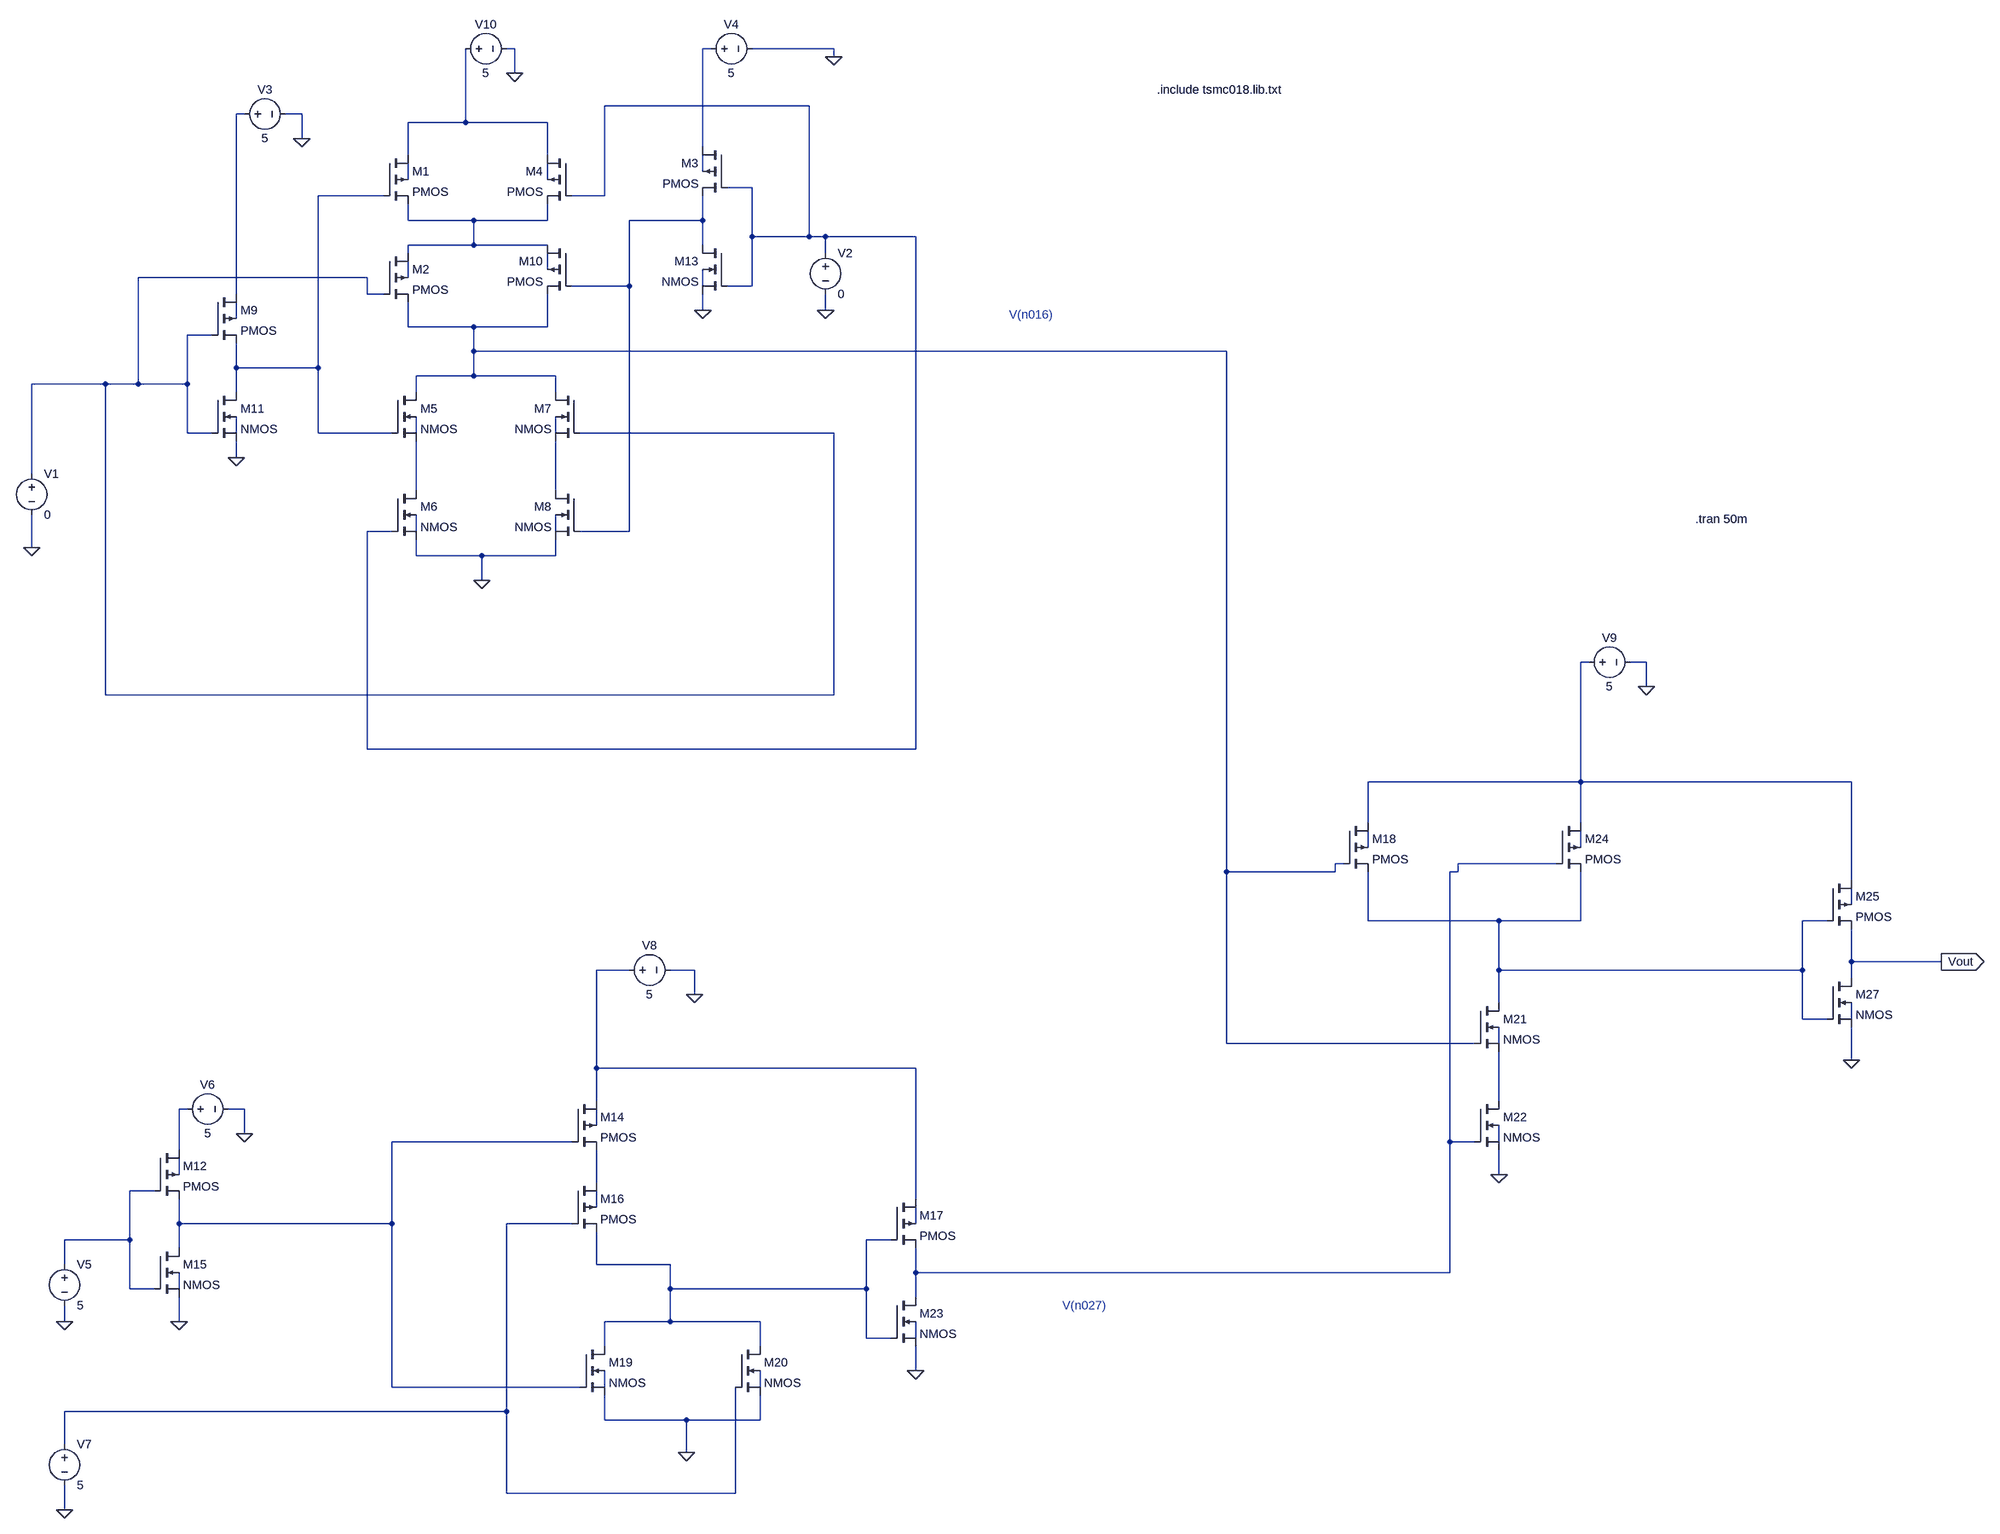
[diagram p0: schematic Analog Mastery Circuit.asc]
Analog Mastery Circuit.asc, the LTspice schematic file:
Version 4
SHEET 1 4448 2804
WIRE 288 -144 272 -144
WIRE 672 -144 656 -144
WIRE 912 -144 752 -144
WIRE 912 -128 912 -144
WIRE 288 -96 288 -144
WIRE 864 -32 464 -32
WIRE -240 -16 -256 -16
WIRE -128 -16 -160 -16
WIRE 192 0 192 -144
WIRE 192 0 80 0
WIRE 352 0 192 0
WIRE -128 32 -128 -16
WIRE 656 48 656 -144
WIRE 80 64 80 0
WIRE 352 64 352 0
WIRE 656 96 656 64
WIRE 80 112 80 80
WIRE 352 112 352 80
WIRE 752 128 704 128
WIRE 32 144 -96 144
WIRE 464 144 464 -32
WIRE 464 144 400 144
WIRE 80 192 80 160
WIRE 208 192 80 192
WIRE 352 192 352 160
WIRE 352 192 208 192
WIRE 656 192 656 144
WIRE 656 192 512 192
WIRE 752 224 752 128
WIRE 864 224 864 -32
WIRE 864 224 752 224
WIRE 896 224 864 224
WIRE 1072 224 896 224
WIRE 208 240 208 192
WIRE 208 240 80 240
WIRE 352 240 208 240
WIRE 656 240 656 192
WIRE 80 256 80 240
WIRE 896 256 896 224
WIRE 352 288 352 256
WIRE 0 304 -448 304
WIRE 80 304 80 272
WIRE 512 320 512 192
WIRE 512 320 400 320
WIRE 656 320 656 288
WIRE 752 320 752 224
WIRE 752 320 704 320
WIRE -256 336 -256 -16
WIRE 0 336 0 304
WIRE 32 336 0 336
WIRE 656 368 656 336
WIRE 896 368 896 336
WIRE -256 384 -256 352
WIRE 80 400 80 352
WIRE 208 400 80 400
WIRE 352 400 352 336
WIRE 352 400 208 400
WIRE -304 416 -352 416
WIRE 208 448 208 400
WIRE 2720 448 208 448
WIRE -256 480 -256 432
WIRE -96 480 -96 144
WIRE -96 480 -256 480
WIRE 208 496 208 448
WIRE 208 496 96 496
WIRE 368 496 208 496
WIRE -512 512 -656 512
WIRE -448 512 -448 304
WIRE -448 512 -512 512
WIRE -352 512 -352 416
WIRE -352 512 -448 512
WIRE -256 528 -256 480
WIRE 96 528 96 496
WIRE 368 528 368 496
WIRE -352 608 -352 512
WIRE -304 608 -352 608
WIRE -256 608 -256 576
WIRE -96 608 -96 480
WIRE 48 608 -96 608
WIRE 96 608 96 576
WIRE 368 608 368 576
WIRE 912 608 416 608
WIRE -256 656 -256 624
WIRE -656 688 -656 512
WIRE 96 720 96 624
WIRE 368 720 368 624
WIRE 48 800 0 800
WIRE 96 800 96 768
WIRE 368 800 368 768
WIRE 512 800 512 320
WIRE 512 800 416 800
WIRE -656 832 -656 768
WIRE 96 848 96 816
WIRE 224 848 96 848
WIRE 368 848 368 816
WIRE 368 848 224 848
WIRE 224 896 224 848
WIRE 3552 1056 3536 1056
WIRE 3664 1056 3632 1056
WIRE 3664 1104 3664 1056
WIRE -512 1120 -512 512
WIRE 912 1120 912 608
WIRE 912 1120 -512 1120
WIRE 0 1248 0 800
WIRE 1072 1248 1072 224
WIRE 1072 1248 0 1248
WIRE 3536 1312 3536 1056
WIRE 3536 1312 3120 1312
WIRE 4160 1312 3536 1312
WIRE 3120 1392 3120 1312
WIRE 3536 1392 3536 1312
WIRE 3120 1440 3120 1408
WIRE 3536 1440 3536 1408
WIRE 3072 1472 3056 1472
WIRE 3488 1472 3296 1472
WIRE 2720 1488 2720 448
WIRE 3056 1488 3056 1472
WIRE 3056 1488 2720 1488
WIRE 3296 1488 3296 1472
WIRE 3296 1488 3280 1488
WIRE 4160 1504 4160 1312
WIRE 4160 1552 4160 1520
WIRE 3120 1584 3120 1488
WIRE 3376 1584 3120 1584
WIRE 3536 1584 3536 1488
WIRE 3536 1584 3376 1584
WIRE 4112 1584 4064 1584
WIRE 4160 1664 4160 1600
WIRE 4336 1664 4160 1664
WIRE 512 1680 448 1680
WIRE 640 1680 592 1680
WIRE 3376 1680 3376 1584
WIRE 4064 1680 4064 1584
WIRE 4064 1680 3376 1680
WIRE 4160 1696 4160 1664
WIRE 640 1728 640 1680
WIRE 3376 1744 3376 1680
WIRE 4064 1776 4064 1680
WIRE 4112 1776 4064 1776
WIRE 4160 1776 4160 1744
WIRE 2720 1824 2720 1488
WIRE 3328 1824 2720 1824
WIRE 3376 1824 3376 1792
WIRE 4160 1856 4160 1792
WIRE 448 1872 448 1680
WIRE 1072 1872 448 1872
WIRE 448 1936 448 1872
WIRE 3376 1936 3376 1840
WIRE -352 1952 -368 1952
WIRE -240 1952 -272 1952
WIRE 448 1984 448 1952
WIRE -240 2000 -240 1952
WIRE 400 2016 48 2016
WIRE 3280 2016 3280 1488
WIRE 3328 2016 3280 2016
WIRE 3376 2016 3376 1984
WIRE -368 2032 -368 1952
WIRE -368 2080 -368 2048
WIRE 3376 2080 3376 2032
WIRE 448 2096 448 2032
WIRE -416 2112 -464 2112
WIRE 1072 2128 1072 1872
WIRE 448 2144 448 2112
WIRE -368 2176 -368 2128
WIRE 48 2176 48 2016
WIRE 48 2176 -368 2176
WIRE 400 2176 272 2176
WIRE 1072 2176 1072 2144
WIRE -464 2208 -464 2112
WIRE -464 2208 -592 2208
WIRE 1024 2208 976 2208
WIRE -368 2224 -368 2176
WIRE -592 2256 -592 2208
WIRE 448 2256 448 2192
WIRE 592 2256 448 2256
WIRE 1072 2272 1072 2224
WIRE 3280 2272 3280 2016
WIRE 3280 2272 1072 2272
WIRE -464 2304 -464 2208
WIRE -416 2304 -464 2304
WIRE -368 2304 -368 2272
WIRE 592 2304 592 2256
WIRE 976 2304 976 2208
WIRE 976 2304 592 2304
WIRE 1072 2320 1072 2272
WIRE -592 2368 -592 2336
WIRE -368 2368 -368 2320
WIRE 592 2368 592 2304
WIRE 592 2368 464 2368
WIRE 768 2368 592 2368
WIRE 976 2400 976 2304
WIRE 1024 2400 976 2400
WIRE 1072 2400 1072 2368
WIRE 464 2416 464 2368
WIRE 768 2416 768 2368
WIRE 1072 2464 1072 2416
WIRE 48 2496 48 2176
WIRE 416 2496 48 2496
WIRE 464 2496 464 2464
WIRE 768 2496 768 2464
WIRE 272 2544 272 2176
WIRE 272 2544 -592 2544
WIRE 464 2560 464 2512
WIRE 624 2560 464 2560
WIRE 768 2560 768 2512
WIRE 768 2560 624 2560
WIRE -592 2608 -592 2544
WIRE 624 2624 624 2560
WIRE 272 2704 272 2544
WIRE 720 2704 720 2496
WIRE 720 2704 272 2704
WIRE -592 2736 -592 2688
FLAG 224 896 0
FLAG -656 832 0
FLAG -256 656 0
FLAG 656 368 0
FLAG 896 368 0
FLAG -128 32 0
FLAG 912 -128 0
FLAG -592 2368 0
FLAG -240 2000 0
FLAG -592 2736 0
FLAG 624 2624 0
FLAG 1072 2464 0
FLAG 640 1728 0
FLAG 3376 2080 0
FLAG 3664 1104 0
FLAG 4160 1856 0
FLAG -368 2368 0
FLAG 4336 1664 Vout
IOPIN 4336 1664 Out
FLAG 288 -96 0
SYMBOL nmos4 48 528 R0
SYMATTR InstName M5
SYMBOL nmos4 48 720 R0
SYMATTR InstName M6
SYMBOL nmos4 416 528 M0
SYMATTR InstName M7
SYMBOL nmos4 416 720 M0
SYMATTR InstName M8
SYMBOL nmos4 -304 528 R0
SYMATTR InstName M11
SYMBOL nmos4 704 240 M0
SYMATTR InstName M13
SYMBOL voltage -656 672 R0
WINDOW 123 0 0 Left 0
WINDOW 39 0 0 Left 0
SYMATTR InstName V1
SYMATTR Value 0
SYMBOL voltage 896 240 R0
WINDOW 123 0 0 Left 0
WINDOW 39 0 0 Left 0
SYMATTR InstName V2
SYMATTR Value 0
SYMBOL voltage -256 -16 R270
WINDOW 0 32 56 VTop 2
WINDOW 3 -32 56 VBottom 2
WINDOW 123 0 0 Left 0
WINDOW 39 0 0 Left 0
SYMATTR InstName V3
SYMATTR Value 5
SYMBOL voltage 656 -144 R270
WINDOW 0 32 56 VTop 2
WINDOW 3 -32 56 VBottom 2
WINDOW 123 0 0 Left 0
WINDOW 39 0 0 Left 0
SYMATTR InstName V4
SYMATTR Value 5
SYMBOL nmos4 -416 2224 R0
SYMATTR InstName M15
SYMBOL voltage -592 2240 R0
WINDOW 123 0 0 Left 0
WINDOW 39 0 0 Left 0
SYMATTR InstName V5
SYMATTR Value 5
SYMBOL voltage -368 1952 R270
WINDOW 0 32 56 VTop 2
WINDOW 3 -32 56 VBottom 2
WINDOW 123 0 0 Left 0
WINDOW 39 0 0 Left 0
SYMATTR InstName V6
SYMATTR Value 5
SYMBOL voltage -592 2592 R0
WINDOW 123 0 0 Left 0
WINDOW 39 0 0 Left 0
SYMATTR InstName V7
SYMATTR Value 5
SYMBOL nmos4 416 2416 R0
SYMATTR InstName M19
SYMBOL nmos4 720 2416 R0
SYMATTR InstName M20
SYMBOL nmos4 1024 2320 R0
SYMATTR InstName M23
SYMBOL voltage 496 1680 R270
WINDOW 0 32 56 VTop 2
WINDOW 3 -32 56 VBottom 2
WINDOW 123 0 0 Left 0
WINDOW 39 0 0 Left 0
SYMATTR InstName V8
SYMATTR Value 5
SYMBOL nmos4 3328 1744 R0
SYMATTR InstName M21
SYMBOL nmos4 3328 1936 R0
SYMATTR InstName M22
SYMBOL nmos4 4112 1696 R0
SYMATTR InstName M27
SYMBOL voltage 3536 1056 R270
WINDOW 0 32 56 VTop 2
WINDOW 3 -32 56 VBottom 2
WINDOW 123 0 0 Left 0
WINDOW 39 0 0 Left 0
SYMATTR InstName V9
SYMATTR Value 5
SYMBOL voltage 176 -144 R270
WINDOW 0 32 56 VTop 2
WINDOW 3 -32 56 VBottom 2
WINDOW 123 0 0 Left 0
WINDOW 39 0 0 Left 0
SYMATTR InstName V10
SYMATTR Value 5
SYMBOL pmos4 -304 336 R0
SYMATTR InstName M9
SYMBOL pmos4 32 64 R0
SYMATTR InstName M1
SYMBOL pmos4 32 256 R0
SYMATTR InstName M2
SYMBOL pmos4 704 48 M0
SYMATTR InstName M3
SYMBOL pmos4 400 64 M0
SYMATTR InstName M4
SYMBOL pmos4 400 240 M0
SYMATTR InstName M10
SYMBOL pmos4 -416 2032 R0
SYMATTR InstName M12
SYMBOL pmos4 400 1936 R0
SYMATTR InstName M14
SYMBOL pmos4 400 2096 R0
SYMATTR InstName M16
SYMBOL pmos4 1024 2128 R0
SYMATTR InstName M17
SYMBOL pmos4 3072 1392 R0
SYMATTR InstName M18
SYMBOL pmos4 3488 1392 R0
SYMATTR InstName M24
SYMBOL pmos4 4112 1504 R0
SYMATTR InstName M25
TEXT 2584 -64 Left 2 !.include tsmc018.lib.txt
TEXT 3760 776 Left 2 !.tran 50m
TEXT 1520 376 Left 2 ;V(n016)
TEXT 1624 2336 Left 2 ;V(n027)

The netlist it stands for:
* Analog Mastery Circuit.asc
M5 N016 N008 N020 N018 NMOS
M6 N020 N002 0 N022 NMOS
M7 N016 N012 N021 N019 NMOS
M8 N021 N010 0 N023 NMOS
M11 N008 N012 0 N017 NMOS
M13 N010 N002 0 N014 NMOS
V1 N012 0 0
V2 N002 0 0
V3 N003 0 5
V4 N001 0 5
M15 N036 N040 0 N045 NMOS
V5 N040 0 5
V6 N034 0 5
V7 N042 0 5
M19 N044 N036 0 N047 NMOS
M20 N044 N042 0 N048 NMOS
M23 N027 N044 0 N046 NMOS
V8 N030 0 5
M21 N029 N016 N033 N032 NMOS
M22 N033 N027 0 N037 NMOS
M27 Vout N029 0 N031 NMOS
V9 N024 0 5
V10 N004 0 5
M9 N003 N012 N008 N015 PMOS
M1 N004 N008 N009 N006 PMOS
M2 N009 N012 N016 N013 PMOS
M3 N001 N002 N010 N005 PMOS
M4 N004 N002 N009 N007 PMOS
M10 N009 N010 N016 N011 PMOS
M12 N034 N040 N036 N038 PMOS
M14 N030 N036 N039 N035 PMOS
M16 N039 N042 N044 N041 PMOS
M17 N030 N044 N027 N043 PMOS
M18 N024 N016 N029 N025 PMOS
M24 N024 N027 N029 N026 PMOS
M25 N024 N029 Vout N028 PMOS
.model NMOS NMOS
.model PMOS PMOS
.lib standard.mos
.include tsmc018.lib.txt
.tran 50m
* V(n016)
* V(n027)
.backanno
.end